# EAGLE design pololu-steppers-power-side (EAGLE 5.06)
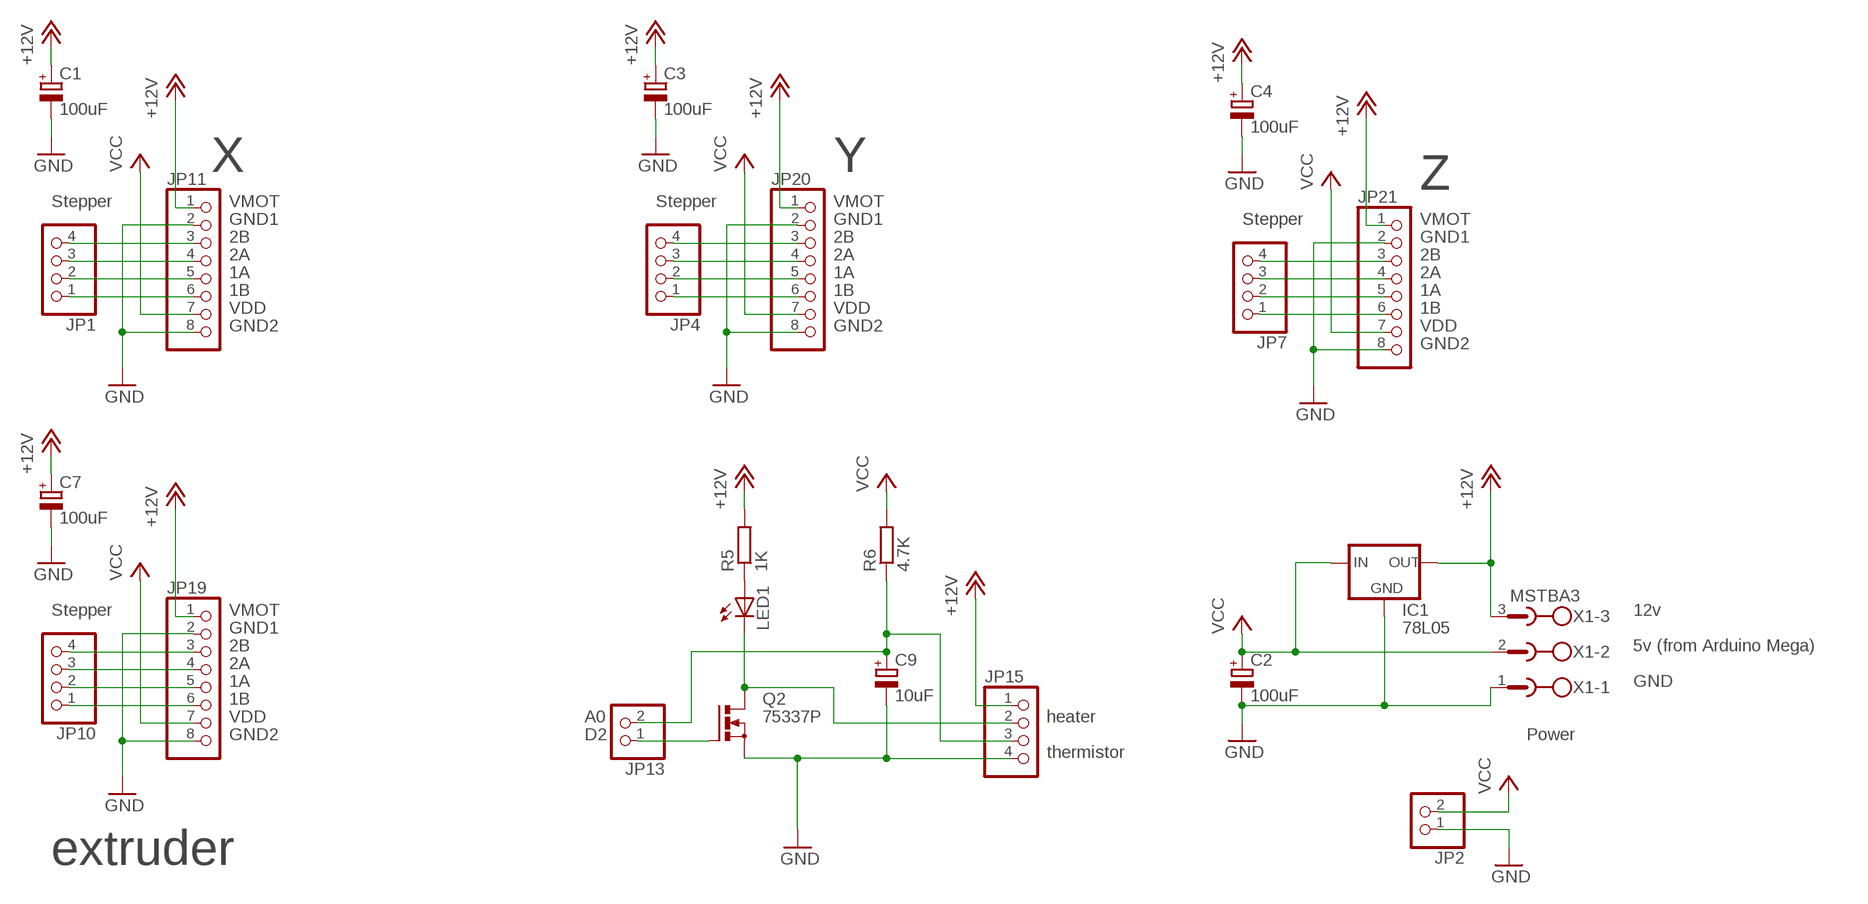
[diagram p0: schematic, sheet 1]

## Parts
C1  100uF  CPOL-EUE3.5-10  [E3,5-10]
C2  100uF  CPOL-EUE3.5-10  [E3,5-10]
C3  100uF  CPOL-EUE3.5-10  [E3,5-10]
C4  100uF  CPOL-EUE3.5-10  [E3,5-10]
C7  100uF  CPOL-EUE3.5-10  [E3,5-10]
C9  10uF  CPOL-EUE5-5  [E5-5]
IC1  78L05  78LXX  [78LXX]
JP1  PINHD-1X4  [1X04]
JP2  PINHD-1X2  [1X02]
JP4  PINHD-1X4  [1X04]
JP7  PINHD-1X4  [1X04]
JP10  PINHD-1X4  [1X04]
JP11  PINHD-1X8  [1X08]
JP13  PINHD-1X2  [1X02]
JP15  PINHD-1X4  [1X04]
JP19  PINHD-1X8  [1X08]
JP20  PINHD-1X8  [1X08]
JP21  PINHD-1X8  [1X08]
LED1  LED3MM  [LED3MM]
Q2  75337P  BUZ11BV  [TO220BV]
R5  1K  R-EU_0207/7  [0207/7]
R6  4.7K  R-EU_0207/7  [0207/7]
X1  MSTBA3  [MSTBA3]

## Nets
+12V: C1.+ C3.+ C4.+ C7.+ IC1.OUT JP11.1 JP15.1 JP19.1 JP20.1 JP21.1 R5.2 X1.3
GND: C1.- C2.- C3.- C4.- C7.- C9.- IC1.GND JP2.1 JP11.2 JP11.8 JP15.4 JP19.2 JP19.8 JP20.2 JP20.8 JP21.2 JP21.8 Q2.S X1.1
N$4: JP4.4 JP20.3
N$5: JP4.3 JP20.4
N$8: JP1.4 JP11.3
N$9: JP1.3 JP11.4
N$10: JP1.2 JP11.5
N$11: JP1.1 JP11.6
N$12: JP4.2 JP20.5
N$13: JP4.1 JP20.6
N$23: JP7.4 JP21.3
N$24: JP7.3 JP21.4
N$25: JP7.2 JP21.5
N$26: JP7.1 JP21.6
N$33: JP10.4 JP19.3
N$34: JP10.3 JP19.4
N$35: JP10.2 JP19.5
N$36: JP10.1 JP19.6
N$41: JP13.1 Q2.G
N$42: JP15.2 LED1.K(C) Q2.D
N$43: LED1.A R5.1
N$44: C9.+ JP13.2 JP15.3 R6.1
VCC: C2.+ IC1.IN JP2.2 JP11.7 JP19.7 JP20.7 JP21.7 R6.2 X1.2

## Notes on the sheet
- X | Y
- Z
- Stepper | VMOT | Stepper | VMOT
- GND1 | GND1 | Stepper | VMOT
- 2B | 2B | GND1
- 2A | 2A | 2B
- 1A | 1A | 2A
- 1B | 1B | 1A
- VDD | VDD | 1B
- GND2 | GND2 | VDD
- GND2
- Stepper | VMOT | 12v
- GND1
- 2B | 5v (from Arduino Mega)
- 2A
- 1A | GND
- 1B
- VDD | A0 | heater
- GND2 | D2 | Power
- thermistor
- extruder

## Library data of the parts
C1-C4 C7 C9 = rcl:CPOL-EU: POLARIZED CAPACITOR, European symbol
IC1 = v-reg:78LXX: VOLTAGE REGULATOR
JP1 JP4 JP7 JP10 JP15 = pinhead:PINHD-1X4: PIN HEADER
JP2 JP13 = pinhead:PINHD-1X2: PIN HEADER
JP11 JP19-JP21 = pinhead:PINHD-1X8: PIN HEADER
LED1 = led:LED: LED OSRAM: - CHIPLED LG R971, LG N971, LY N971, LG Q971, LY Q971, LO R971, LY R971 LH N974, LH R974 LS Q976, LO Q976, LY Q976 LO Q996 - Hyper CHIPLED LW Q18S LB Q993, LB Q99A, LB R99A - SideLED LS A670, LO A670, LY A670, LG A670, LP A670 LB A673, LV A673, LT A673, LW A673 LH A674 LY A675 LS A676, LA A676, LO A676, LY A676, LW A676 LS A679, LY A679, LG A679 - Hyper Micro SIDELED® LS Y876, LA Y876, LO Y876, LY Y876 LT Y87S - SmartLED LW L88C, LW L88S LB L89C, LB L89S, LG L890 LS L89K, LO L89K, LY L89K LS L896, LA L896, LO L896, LY L896 - TOPLED LS T670, LO T670, LY T670, LG T670, LP T670 LSG T670, LSP T670, LSY T670, LOP T670, LYG T670 LG T671, LOG T671, LSG T671 LB T673, LV T673, LT T673, LW T673 LH T674 LS T676, LA T676, LO T676, LY T676, LB T676, LH T676, LSB T676, LW T676 LB T67C, LV T67C, LT T67C, LS T67K, LO T67K, LY T67K, LW E67C LS E67B, LA E67B, LO E67B, LY E67B, LB E67C, LV E67C, LT E67C LW T67C LS T679, LY T679, LG T679 LS T770, LO T770, LY T770, LG T770, LP T770 LB T773, LV T773, LT T773, LW T773 LH T774 LS E675, LA E675, LY E675, LS T675 LS T776, LA T776, LO T776, LY T776, LB T776 LHGB T686 LT T68C, LB T68C - Hyper Mini TOPLED® LB M676 - Mini TOPLED Santana® LG M470 LS M47K, LO M47K, LY M47K Source: http://www.osram.convergy.de LUXEON: - LUMILED® LXK2-PW12-R00, LXK2-PW12-S00, LXK2-PW14-U00, LXK2-PW14-V00 LXK2-PM12-R00, LXK2-PM12-S00, LXK2-PM14-U00 LXK2-PE12-Q00, LXK2-PE12-R00, LXK2-PE12-S00, LXK2-PE14-T00, LXK2-PE14-U00 LXK2-PB12-K00, LXK2-PB12-L00, LXK2-PB12-M00, LXK2-PB14-N00, LXK2-PB14-P00, LXK2-PB14-Q00 LXK2-PR12-L00, LXK2-PR12-M00, LXK2-PR14-Q00, LXK2-PR14-R00 LXK2-PD12-Q00, LXK2-PD12-R00, LXK2-PD12-S00 LXK2-PH12-R00, LXK2-PH12-S00 LXK2-PL12-P00, LXK2-PL12-Q00, LXK2-PL12-R00 Source: www.luxeon.com KINGBRIGHT: KA-3528ASYC Source: www.kingbright.com
Q2 = transistor-power:BUZ11: N-CHANNEL MOS FET
R5 R6 = rcl:R-EU_: RESISTOR, European symbol
X1 = con-phoenix-508:MSTBA3: PHOENIX

## Board
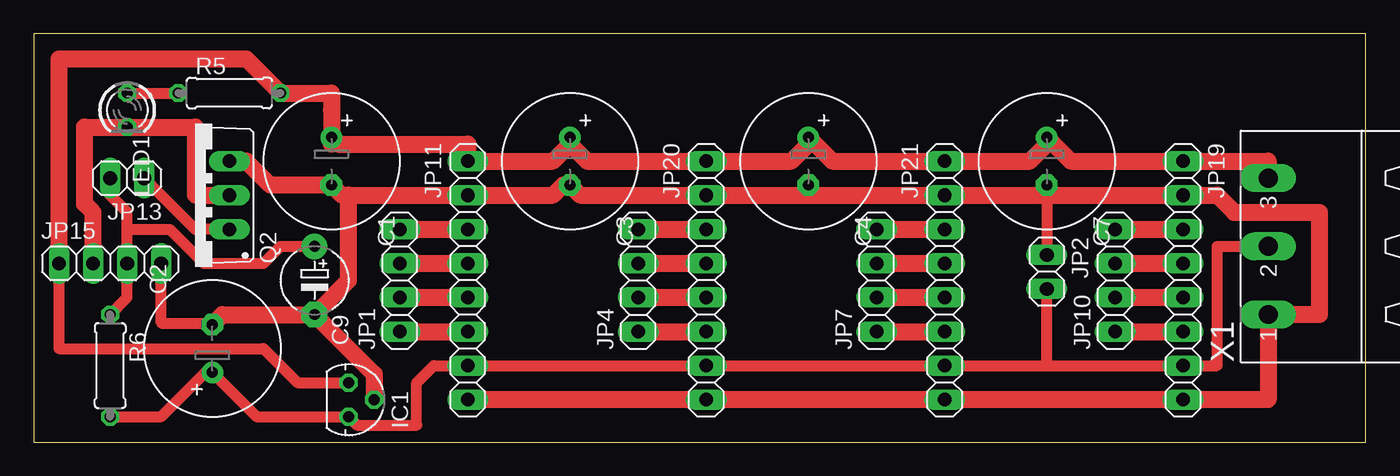
[diagram p1: board, top side]
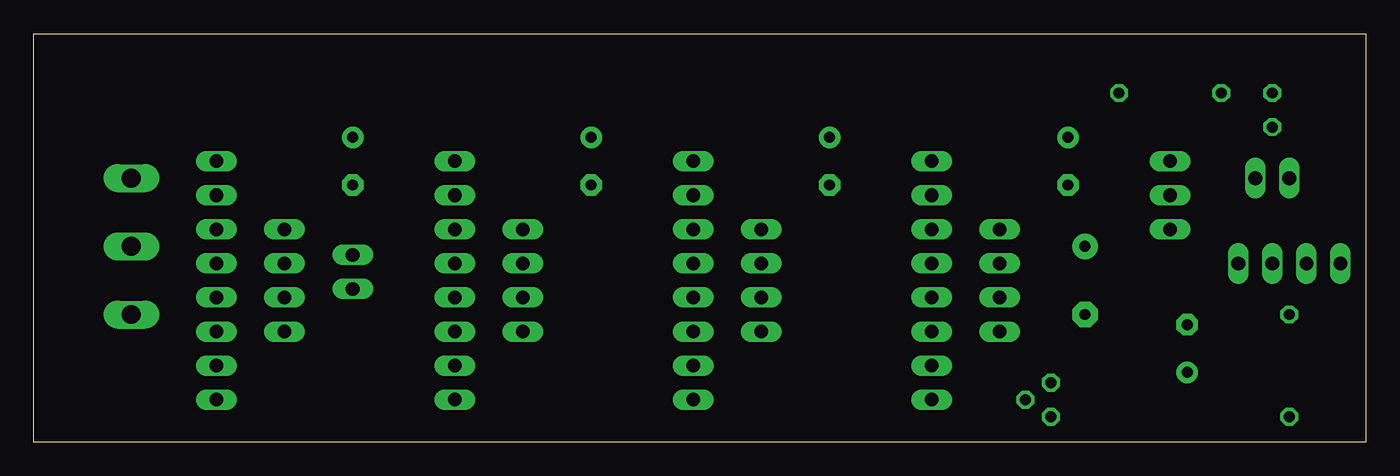
[diagram p2: board, bottom side, seen from below]

Size 99.36 x 30.47 mm. Coordinates in mm from the lower left corner, seen from the top.
Outline: 0,0 99.36,0 99.36,30.47 0,30.47 0,0
Copper layers (1*16): Top 0.035mm / dielectric 1.5mm / Bottom 0.035mm
Design rules "default": minimum track width 10mil, minimum drill 24mil, track to track 8mil, track to pad 8mil, pad to pad 8mil, via to via 8mil, smd to smd 8mil, copper to edge 40mil, drill to drill 8mil, minimum pad ring 10mil, minimum via ring 8mil, stop-mask expansion 4mil, vias tented up to drill 0mil, thermal gap 10mil

### Footprints (pad centres in the part's own frame; a part is rotated, then mirrored left to right if it is on the bottom)
E3,5-10 = drill 0.813 pad 1.6 round: + -1.778,0 | drill 0.813 pad 1.6 octagon: - 1.778,0
E5-5 = drill 0.813 pad 1.905 round: + -2.54,0 | drill 0.813 pad 1.905 octagon: - 2.54,0
78LXX = drill 0.813 octagon: GND 0,1.905; IN 1.27,0; OUT -1.27,0
1X04 = drill 1.016 long: 1 -3.81,0; 2 -1.27,0; 3 1.27,0; 4 3.81,0
1X02 = drill 1.016 long: 1 -1.27,0; 2 1.27,0
1X08 = drill 1.016 long: 1 -8.89,0; 2 -6.35,0; 3 -3.81,0; 4 -1.27,0; 5 1.27,0; 6 3.81,0; 7 6.35,0; 8 8.89,0
LED3MM = drill 0.813 octagon: A -1.27,0; K 1.27,0
TO220BV = drill 1.016 long: D 0,-2.54; G -2.54,-2.54; S 2.54,-2.54
0207/7 = drill 0.813 octagon: 1 -3.81,0; 2 3.81,0
MSTBA3 = drill 1.397 long: 1 -5.08,5.08; 2 0,5.08; 3 5.08,5.08

### Placement (x,y rotation side)
C1  22.23,20.96 270 top
C2  13.34,6.98 90 top
C3  40.01,20.96 270 top
C4  57.78,20.96 270 top
C7  75.56,20.96 270 top
C9  20.96,12.07 270 top
IC1  23.5,3.18 270 top
JP1  27.3,12.07 90 top
JP2  75.56,12.7 270 top
JP4  45.09,12.07 90 top
JP7  62.86,12.07 90 top
JP10  80.64,12.07 90 top
JP11  32.38,12.07 270 top
JP13  6.99,19.68 180 top
JP15  5.71,13.34 0 top
JP19  85.72,12.07 270 top
JP20  50.16,12.07 270 top
JP21  67.95,12.07 270 top
LED1  6.99,24.76 270 top
Q2  12.07,18.42 90 top
R5  14.61,26.04 0 top
R6  5.71,5.71 270 top
X1  97.16,14.61 90 top

### Tracks (layer width: path | path; a pad name or v marks a point on that pad's centre or on a via)
+12V
  Top 0.406: 75.56,22.22 C7.+ | 57.78,22.22 C4.+ | 40.01,22.22 C3.+ | 22.23,24.76 C1.+ 22.73,22.22 22.23,22.22
  Top 0.813: IC1.OUT 19.69,4.45 17.14,6.98 1.91,6.98 JP15.1
  Top 1.27: X1.3 92.08,20.96 JP19.1 77.34,20.96 C7.+ | 75.56,22.22 74.3,20.96 JP21.1 59.56,20.96 C4.+ | 57.78,22.22 56.52,20.96 JP20.1 41.27,20.96 40.01,22.22 38.73,20.96 JP11.1 32.38,22.22 22.73,22.22 | 22.23,22.22 22.23,24.76 22.23,26.04 R5.2 15.88,28.57 1.91,28.57 JP15.1
  Bottom 0.254: C3.+ 40.01,22.22
GND
  Top 0.406: 23.5,18.42 22.99,18.42
  Top 0.813: JP15.4 9.53,8.89 13.21,8.89 C2.- | C7.- JP2.1
  Top 1.27: JP11.8 JP20.8 JP21.8 JP19.8 92.08,3.18 X1.1 95.89,9.52 95.89,17.14 89.53,17.14 88.27,18.42 JP19.2 75.56,18.42 | 75.56,18.42 JP21.2 57.78,18.42 | 75.56,18.42 C7.- | 57.78,18.42 JP20.2 40.77,18.42 C3.- 39.5,19.18 38.73,18.42 JP11.2 23.5,18.42 23.5,12.07 C9.- | 57.78,18.42 C4.- | Q2.S 15.88,20.96 17.65,19.18 C1.- 22.99,18.42 | C9.- 14.1,9.52 C2.- | IC1.GND 25.4,5.08 C9.-
N$4
  Top 1.27: JP4.4 JP20.3
N$5
  Top 1.27: JP4.3 JP20.4
N$8
  Top 1.27: JP1.4 JP11.3
N$9
  Top 1.27: JP1.3 JP11.4
N$10
  Top 1.27: JP1.2 JP11.5
N$11
  Top 1.27: JP1.1 JP11.6
N$12
  Top 1.27: JP4.2 JP20.5
N$13
  Top 1.27: JP4.1 JP20.6
N$23
  Top 1.27: JP7.4 JP21.3
N$24
  Top 1.27: JP7.3 JP21.4
N$25
  Top 1.27: JP7.2 JP21.5
N$26
  Top 1.27: JP7.1 JP21.6
N$33
  Top 1.27: JP10.4 JP19.3
N$34
  Top 1.27: JP10.3 JP19.4
N$35
  Top 1.27: JP10.2 JP19.5
N$36
  Top 1.27: JP10.1 JP19.6
N$41
  Top 0.813: Q2.G 12.07,15.88 JP13.1
N$42
  Top 1.27: Q2.D 12.07,18.42 12.07,23.5 LED1.K 3.81,23.5 3.81,17.78 4.44,17.14 JP15.2
N$43
  Top 0.813: LED1.A R5.1
N$44
  Top 0.813: JP13.2 5.71,18.42 6.99,17.14 6.99,15.88 | 6.99,15.88 JP15.3 6.99,10.79 R6.1 | C9.+ 18.41,14.61 17.14,13.34 12.7,13.34 10.16,15.88 6.99,15.88
VCC
  Top 0.406: 12.83,5.21 C2.+
  Top 0.813: 75.56,5.71 JP21.7 JP20.7 JP11.7 29.84,5.71 28.58,4.45 28.58,1.27 24.13,1.27 IC1.IN 16.64,1.91 C2.+ | 75.56,5.71 JP19.7 88.27,5.71 88.27,14.61 X1.2 | 12.83,5.21 9.53,1.91 R6.2 | 75.56,5.71 JP2.2